# EAGLE design FAIO-Braille (EAGLE 7.7.0)
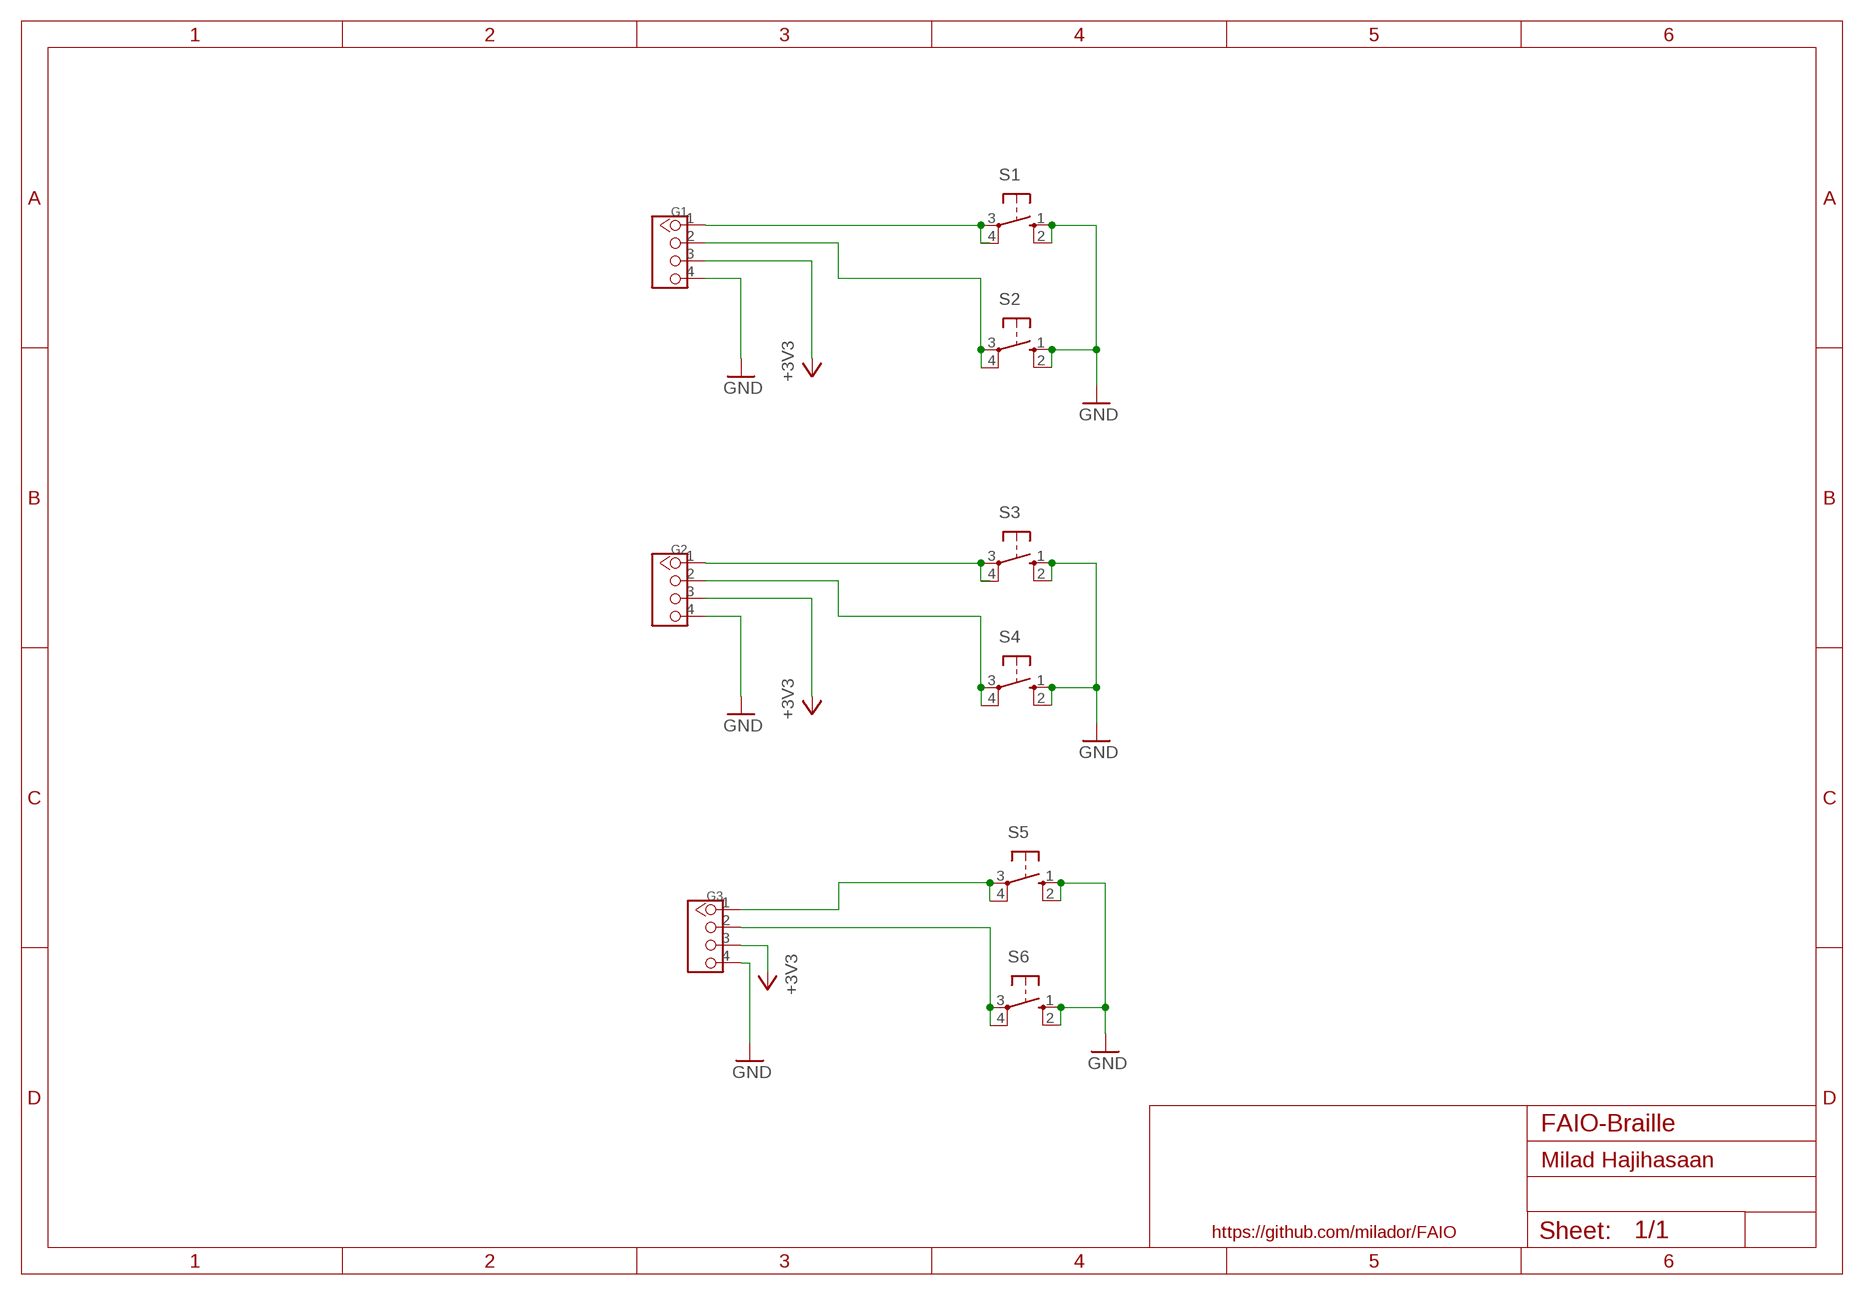
[diagram p0: schematic, sheet 1]

## Parts
G1  TWIG-4P-2.0'90D'  [4P-2.0-90D]
G2  TWIG-4P-2.0'90D'  [4P-2.0-90D]
G3  TWIG-4P-2.0'90D'  [4P-2.0-90D]
S1  10-XX  [B3F-10XX]
S2  10-XX  [B3F-10XX]
S3  10-XX  [B3F-10XX]
S4  10-XX  [B3F-10XX]
S5  10-XX  [B3F-10XX]
S6  10-XX  [B3F-10XX]

## Nets
+3V3: G1.3 G2.3 G3.3
GND: G1.4 G2.4 G3.4 S1.1(S) S1.2(S1) S2.1(S) S2.2(S1) S3.1(S) S3.2(S1) S4.1(S) S4.2(S1) S5.1(S) S5.2(S1) S6.1(S) S6.2(S1)
N$1: G1.1 S1.3(P) S1.4(P1)
N$2: G1.2 S2.3(P) S2.4(P1)
N$3: G2.1 S3.3(P) S3.4(P1)
N$5: G2.2 S4.3(P) S4.4(P1)
N$17: G3.2 S6.3(P) S6.4(P1)
N$18: G3.1 S5.3(P) S5.4(P1)

## Notes on the sheet
- Milad Hajihasaan
- https://github.com/milador/FAIO

## Library data of the parts
G1-G3 = Connector:TWIG-4P-2.0
S1-S6 = switch-omron:10-XX: OMRON SWITCH; MPN: B3F-1000; OC_FARNELL: 176432; OC_NEWARK: 36M3542

## Board
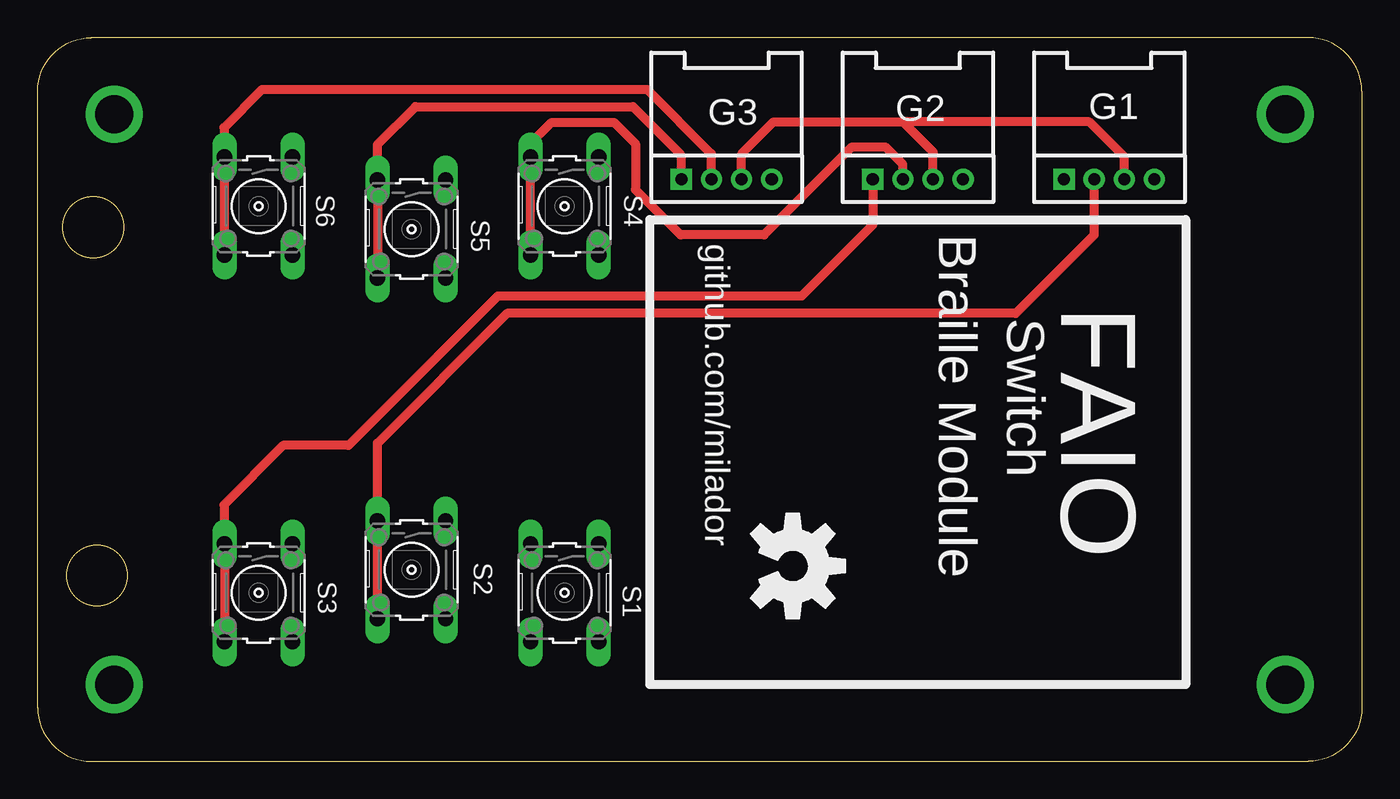
[diagram p1: board, top side]
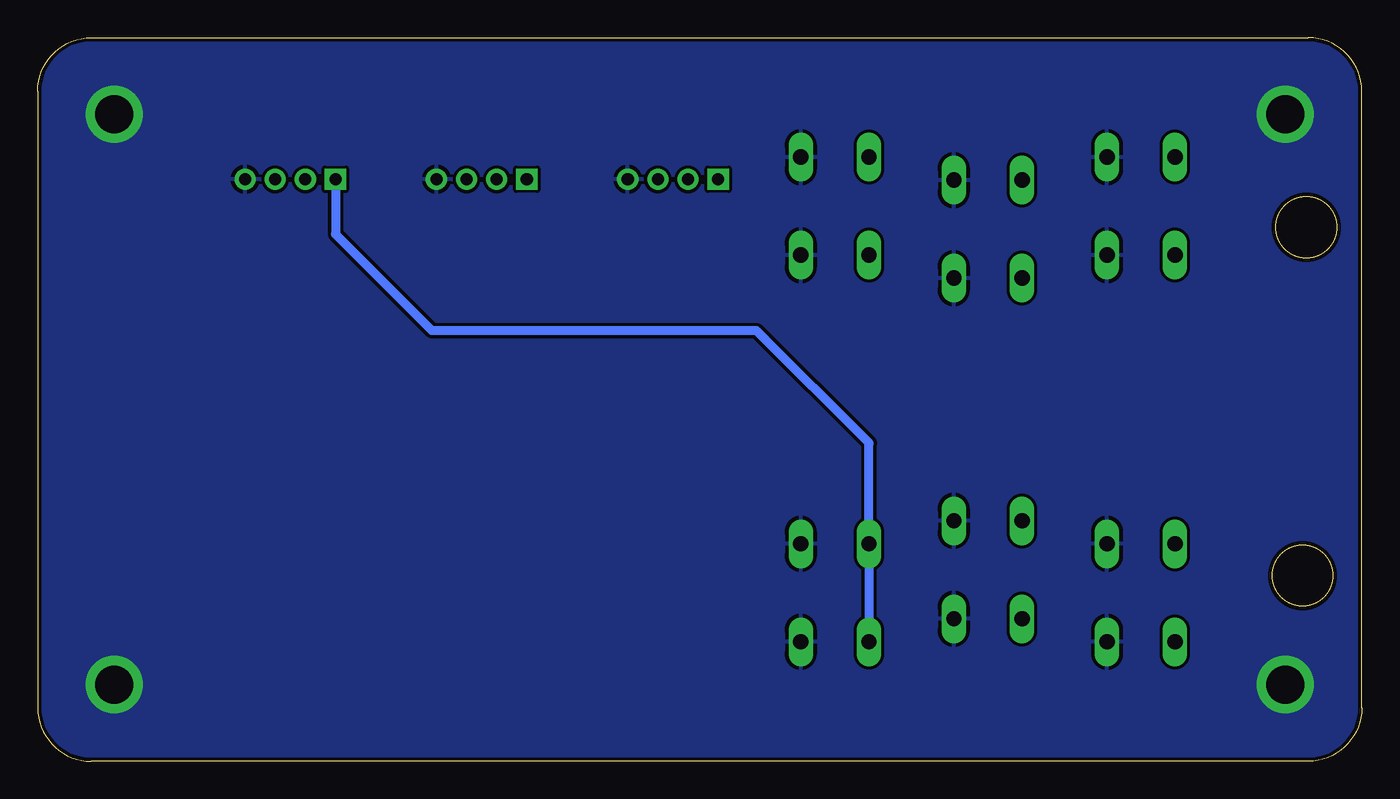
[diagram p2: board, bottom side, seen from below]

Size 87.88 x 48.01 mm. Coordinates in mm from the lower left corner, seen from the top.
Outline: 3.56,0 84.33,0 arc90 87.88,3.56 87.88,44.45 arc90 84.33,48.01 3.56,48.01 arc90 0,44.45 0,3.56 arc90 3.56,0
Outline: circle at 3.68,35.43 radius 2.02
Outline: circle at 3.94,12.32 radius 2.02
Copper layers (1*16): Top 0.035mm / dielectric 1.5mm / Bottom 0.035mm
Design rules "SparkFun": minimum track width 8mil, minimum drill 20mil, track to track 8mil, track to pad 8mil, pad to pad 8mil, via to via 8mil, smd to smd 8mil, copper to edge 10mil, drill to drill 8mil, minimum pad ring 12mil, minimum via ring 10mil, stop-mask expansion 4mil, vias tented up to drill 25mil, thermal gap 10mil

### Footprints (pad centres in the part's own frame; a part is rotated, then mirrored left to right if it is on the bottom)
4P-2.0-90D = drill 0.8 pad 1.27 square: 1 -3,0 | drill 0.8 pad 1.27: 2 -1,0; 3 1,0; 4 3,0
B3F-10XX = drill 1.016 long: 1 -3.251,2.261; 2 3.251,2.261; 3 -3.251,-2.261; 4 3.251,-2.261

### Placement (x,y rotation side)
G1  71.12,38.61 0 top
G2  58.42,38.61 0 top
G3  45.72,38.61 0 top
S1  34.98,11.18 270 top
S2  24.82,12.7 270 top
S3  14.66,11.18 270 top
S4  34.98,36.83 270 top
S5  24.82,35.31 270 top
S6  14.66,36.83 270 top
U$1  [OSHW-LOGO-L]  50.11,12.95 270 top

### Tracks (layer width: path | path; a pad name or v marks a point on that pad's centre or on a via)
+3V3
  Top 0.61: 57.43,42.42 69.8,42.42 72.12,40.1 G1.3 | G2.3 59.42,40.43 57.43,42.42 | G3.3 46.72,40.29 48.84,42.42 57.43,42.42
GND  (via drill 2.5 pad 3.81)
  other vias: 82.8,42.93 82.8,5.08 5.08,5.08 5.08,42.93
  pour Bottom: -0.25,48.26 -0.25,-0.25 88.14,-0.25 88.14,48.26
N$1
  Bottom 0.61: S1.4 S1.3 32.72,21.06 32.69,21.08 40.18,28.57 61.72,28.57 68.12,34.97 G1.1
N$2
  Top 0.61: 22.55,21.11 31.17,29.72 64.92,29.72 70.13,34.92 70.13,38.6 G1.2 | 22.55,21.11 22.53,21.08 | 22.55,21.11 S2.3 S2.4
N$3
  Top 0.61: S3.4 S3.3 12.37,14.45 12.37,17.02 16.31,20.95 20.62,20.95 30.53,30.86 48.77,30.86 49.28,30.86 50.7,30.86 55.42,35.58 G2.1
N$5
  Top 0.61: S4.4 S4.3 32.69,40.11 32.69,40.97 34.11,42.39 38.25,42.39 39.67,40.97 39.67,37.92 42.67,34.92 48.21,34.92 54.05,40.77 56.26,40.77 57.42,39.61 G2.2
N$17
  Top 0.61: S6.4 S6.3 12.37,40.11 12.37,42.04 14.91,44.58 40.44,44.58 44.7,40.31 44.7,38.62 G3.2
N$18
  Top 0.61: S5.4 S5.3 22.53,38.58 22.53,40.89 25.07,43.43 39.5,43.43 42.7,40.23 42.7,38.63 G3.1

### Text on the board
tNames: Braille Module | github.com/milador | FAIO | Switch